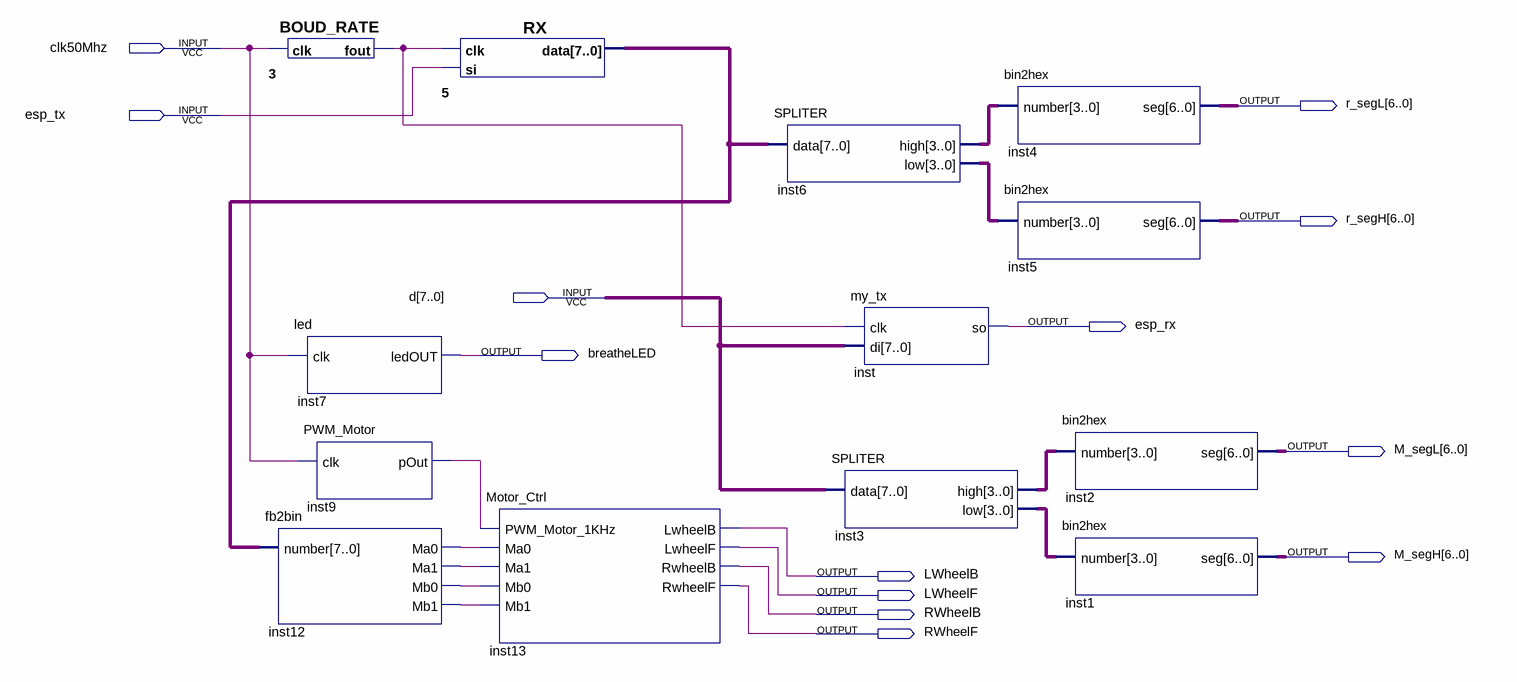
[diagram p0: schematic sheet]
// Quartus schematic Altera_Tutorial_Schematic.bdf as structural Verilog: 13 symbols, 13 pins
module Altera_Tutorial_Schematic (
  input  clk50Mhz,
  input  esp_tx,
  input  [7:0] d,
  output [6:0] r_segL,
  output [6:0] r_segH,
  output esp_rx,
  output breatheLED,
  output [6:0] M_segL,
  output [6:0] M_segH,
  output LWheelB,
  output LWheelF,
  output RWheelB,
  output RWheelF
);

  wire inst9_pout, inst12_ma0, inst12_ma1, inst12_mb0, inst12_mb1, n3_fout;
  wire [3:0] inst3_high, inst3_low, inst6_high, inst6_low;
  wire [7:0] n5_data;

  BOUD_RATE u_3 (.clk(clk50Mhz), .fout(n3_fout));
  led inst7 (.clk(clk50Mhz), .ledOUT(breatheLED));
  fb2bin inst12 (.number(n5_data), .Ma0(inst12_ma0), .Ma1(inst12_ma1), .Mb0(inst12_mb0), .Mb1(inst12_mb1));
  PWM_Motor inst9 (.clk(clk50Mhz), .pOut(inst9_pout));
  RX u_5 (.clk(n3_fout), .si(esp_tx), .data(n5_data));
  Motor_Ctrl inst13 (
    .PWM_Motor_1KHz(inst9_pout), .Ma0(inst12_ma0), .Ma1(inst12_ma1), .Mb0(inst12_mb0), .Mb1(inst12_mb1),
    .LwheelB(LWheelB), .LwheelF(LWheelF), .RwheelB(RWheelB), .RwheelF(RWheelF));
  SPLITER inst6 (.data(n5_data), .high(inst6_high), .low(inst6_low));
  SPLITER inst3 (.data(d), .high(inst3_high), .low(inst3_low));
  my_tx inst (.clk(n3_fout), .di(d), .so(esp_rx));
  bin2hex inst4 (.number(inst6_high), .seg(r_segL));
  bin2hex inst5 (.number(inst6_low), .seg(r_segH));
  bin2hex inst2 (.number(inst3_high), .seg(M_segL));
  bin2hex inst1 (.number(inst3_low), .seg(M_segH));
endmodule
